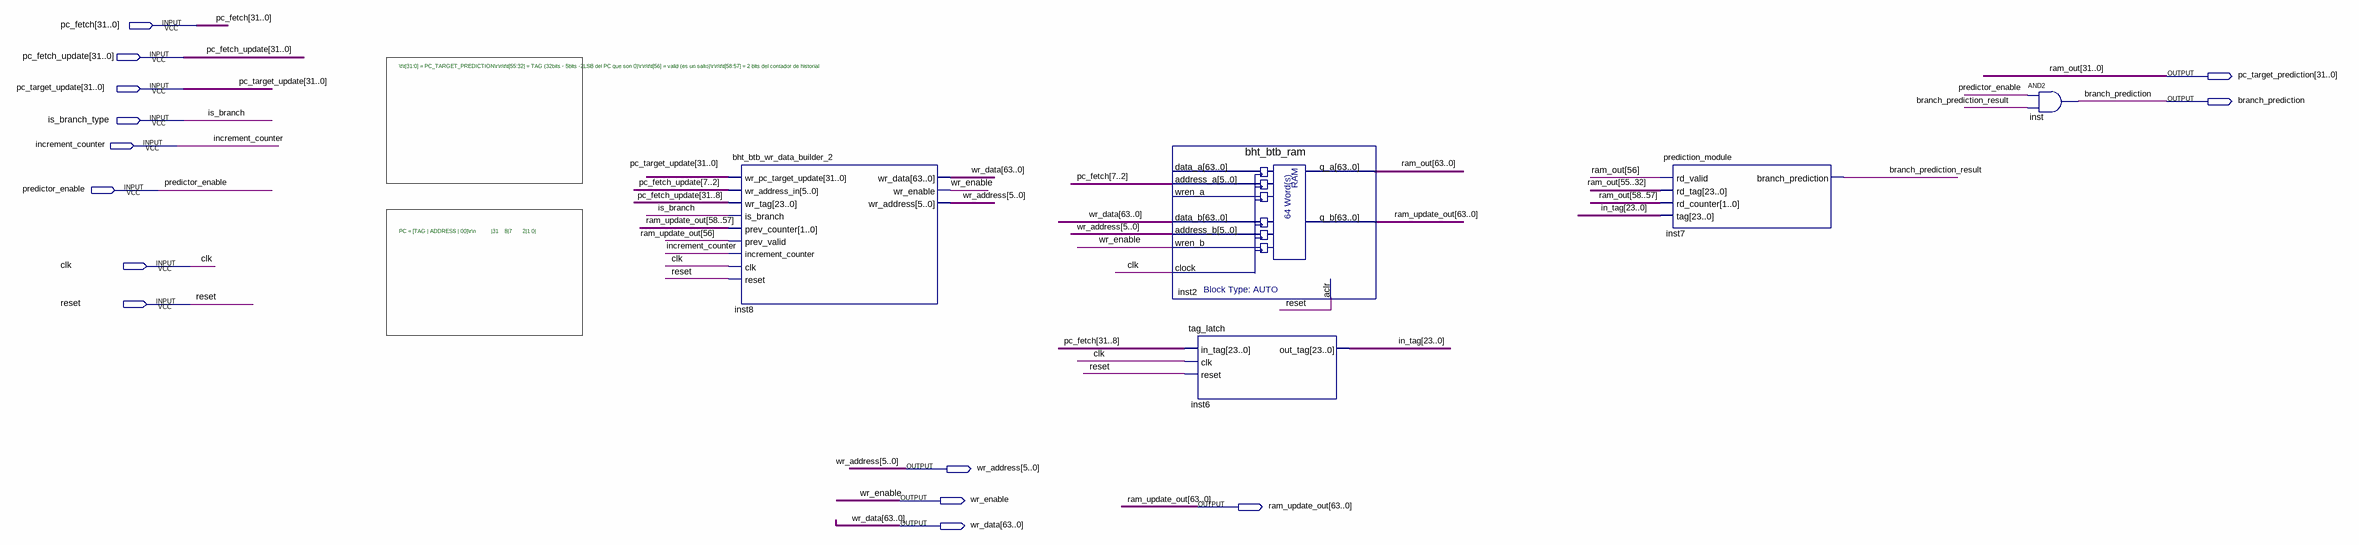
[diagram p0: schematic sheet]
// Quartus schematic bht_btb_module_2.bdf as structural Verilog: 5 symbols, 14 pins
module bht_btb_module_2 (
  input  [31:0] pc_fetch,
  input  [31:0] pc_fetch_update,
  input  [31:0] pc_target_update,
  input  is_branch_type,
  input  increment_counter,
  input  predictor_enable,
  input  clk,
  input  reset,
  output [31:0] pc_target_prediction,
  output branch_prediction,
  output [5:0] wr_address,
  output wr_enable,
  output [63:0] ram_update_out,
  output [63:0] wr_data
);

  wire branch_prediction_result;
  wire [23:0] in_tag;
  wire [63:32] ram_out;

  bht_btb_wr_data_builder_2 inst8 (
    .wr_pc_target_update(pc_target_update), .wr_address_in(pc_fetch_update[7:2]),
    .wr_tag(pc_fetch_update[31:8]), .is_branch(is_branch_type), .prev_counter(ram_update_out[58:57]),
    .prev_valid(ram_update_out[56]), .increment_counter(increment_counter), .clk(clk), .reset(reset),
    .wr_data(wr_data), .wr_enable(wr_enable), .wr_address(wr_address));
  bht_btb_ram inst2 (
    .address_a(pc_fetch[7:2]), .data_b(wr_data), .address_b(wr_address), .wren_b(wr_enable), .clock(clk),
    .aclr(reset), .q_a({ram_out, pc_target_prediction}), .q_b(ram_update_out));  // open: data_a, wren_a
  tag_latch inst6 (.in_tag(pc_fetch[31:8]), .clk(clk), .reset(reset), .out_tag(in_tag));
  prediction_module inst7 (
    .rd_valid(ram_out[56]), .rd_tag(ram_out[55:32]), .rd_counter(ram_out[58:57]), .tag(in_tag),
    .branch_prediction(branch_prediction_result));
  and inst (branch_prediction, predictor_enable, branch_prediction_result);

  // Other names for the same wires on the sheet: is_branch = is_branch_type; ram_out[31:0] = pc_target_prediction

  // Notes on the sheet:
  //   \t\t[31:0] = PC_TARGET_PREDICTION\r\n\t\t[55:32] = TAG (32bits - 5bits -2LSB del PC que son 0)\r\n\t\t[56] = valid (es un salto)\r\n\t\t[58:57] = 2 bits del contador de historial
  //   PC = [TAG | ADDRESS | 00]\r\n          |31    8|7       2|1 0|
endmodule
